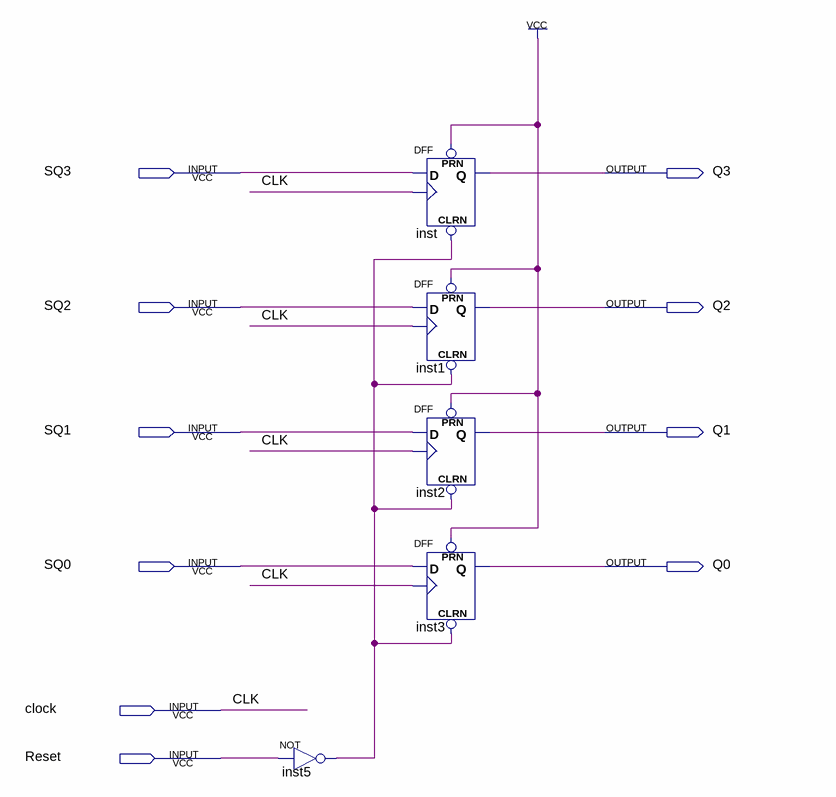
[diagram p0: schematic sheet]
// Quartus schematic Memoria.bdf as structural Verilog: 5 symbols, 10 pins
module Memoria (
  input  SQ3,
  input  SQ2,
  input  SQ1,
  input  SQ0,
  input  clock,
  input  Reset,
  output Q3,
  output Q2,
  output Q1,
  output Q0
);

  wire inst5_out;

  not inst5 (inst5_out, Reset);
  DFF inst (.CLRN(inst5_out), .CLK(clock), .D(SQ3), .PRN(1'b1), .Q(Q3));
  DFF inst1 (.CLRN(inst5_out), .CLK(clock), .D(SQ2), .PRN(1'b1), .Q(Q2));
  DFF inst2 (.CLRN(inst5_out), .CLK(clock), .D(SQ1), .PRN(1'b1), .Q(Q1));
  DFF inst3 (.CLRN(inst5_out), .CLK(clock), .D(SQ0), .PRN(1'b1), .Q(Q0));

  // Other names for the same wires on the sheet: CLK = clock
endmodule
